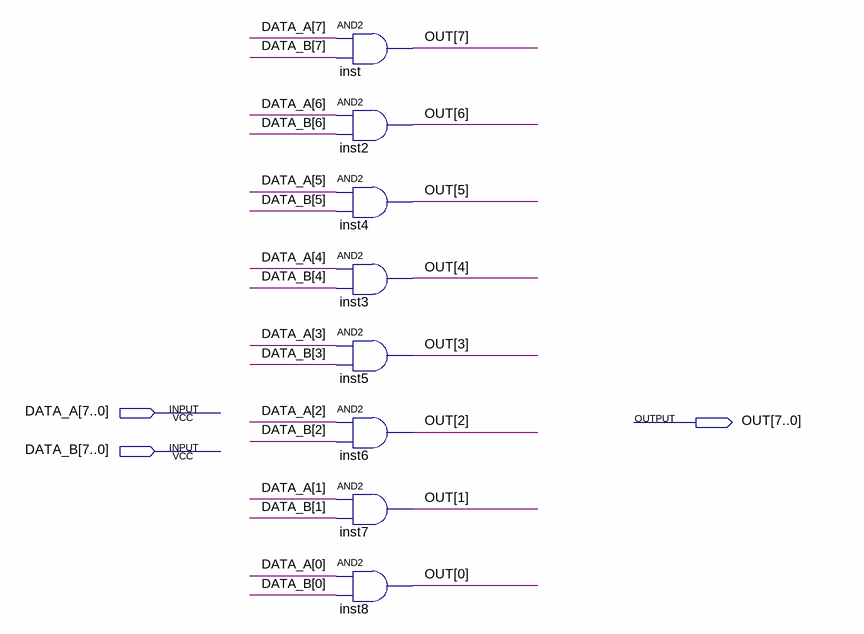
[diagram p0: schematic sheet]
// Quartus schematic AND8bit.bdf as structural Verilog: 8 symbols, 3 pins
module AND8bit (
  input  [7:0] DATA_A,
  input  [7:0] DATA_B,
  output [7:0] OUT
);

  and inst (OUT[7], DATA_A[7], DATA_B[7]);
  and inst2 (OUT[6], DATA_A[6], DATA_B[6]);
  and inst4 (OUT[5], DATA_A[5], DATA_B[5]);
  and inst3 (OUT[4], DATA_A[4], DATA_B[4]);
  and inst5 (OUT[3], DATA_A[3], DATA_B[3]);
  and inst6 (OUT[2], DATA_A[2], DATA_B[2]);
  and inst7 (OUT[1], DATA_A[1], DATA_B[1]);
  and inst8 (OUT[0], DATA_A[0], DATA_B[0]);
endmodule
